# Altium schematic sheet CW308_TargetBoard.SchDoc: Target Connectors
size Letter; ApprovedBy: N; Organization: NewAE Technology Inc.; Address1: 1083 Queen St., Suite 196; Address2: Halifax; Address3: NS; Address4: Canada B3H 0B2; DocumentNumber: 5; SheetNumber: 5; SheetTotal: 5; SheetApproved: YES
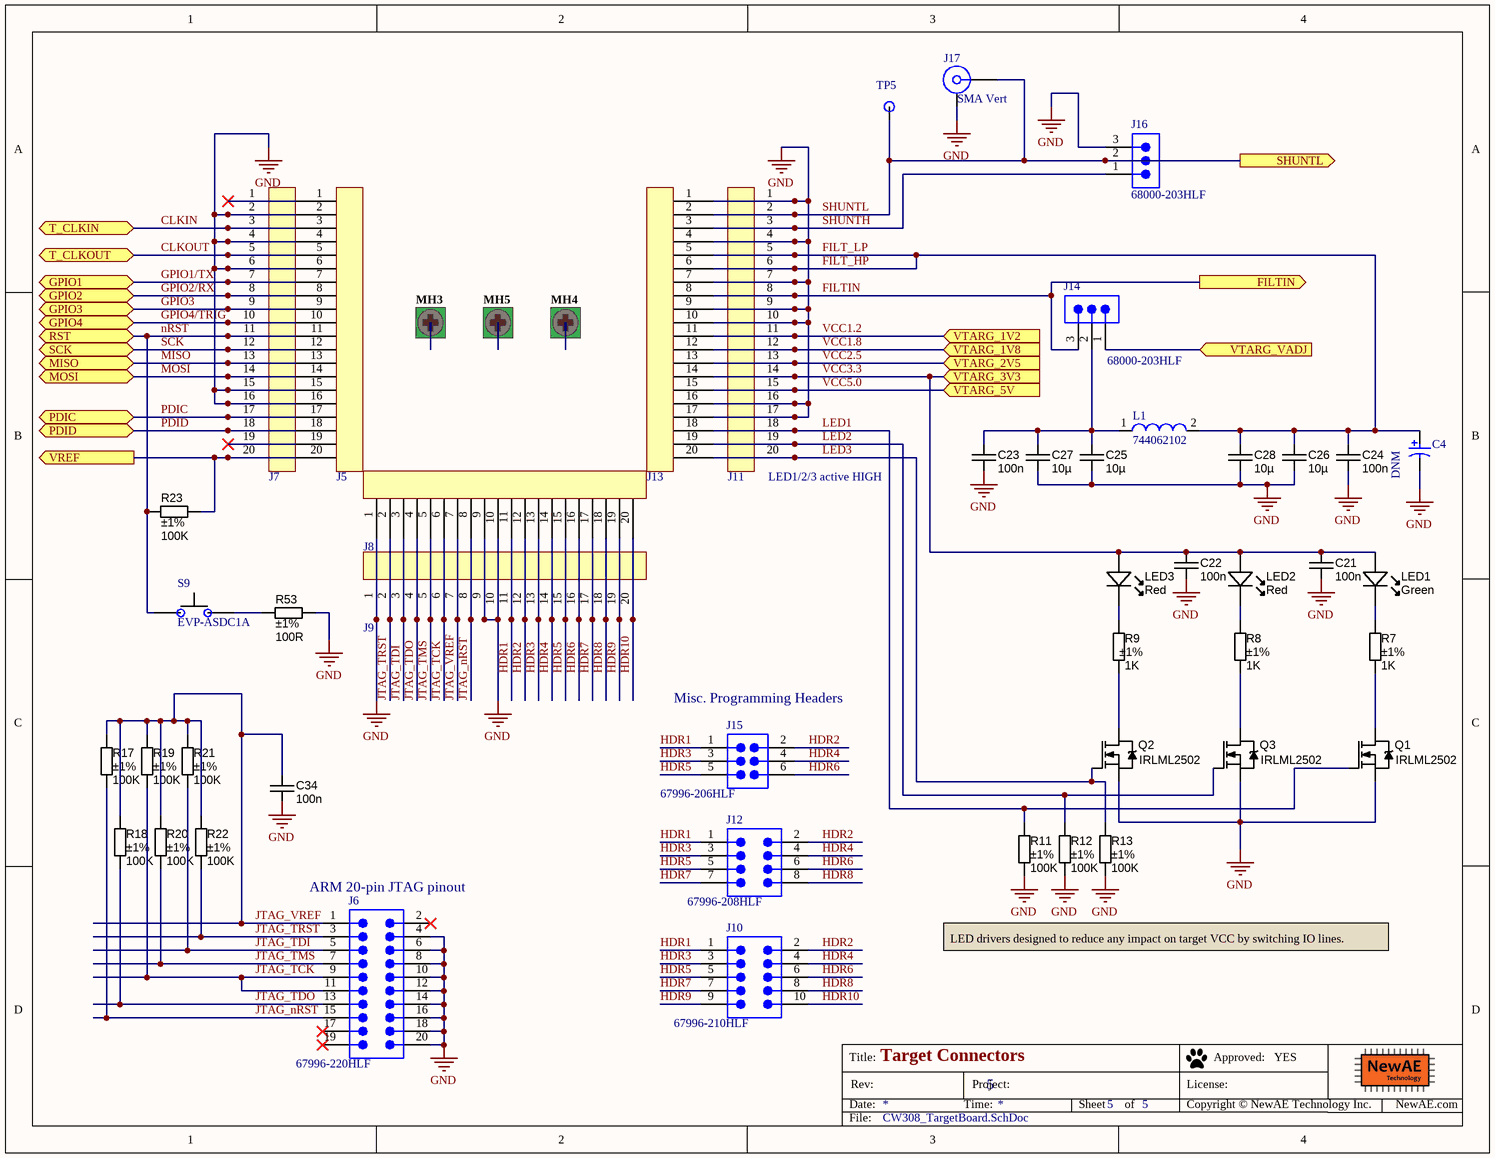
[diagram p0: CW308_TargetBoard.SchDoc]

## Parts
C4  DNM  [NIC-CAPA2-6.3X5.8_V]
C21  value 100n  [CAPC1608X90N]  (hidden comment: approved sub OK)
C22  value 100n  [CAPC1608X90N]  (hidden comment: approved sub OK)
C23  value 100n  [CAPC1608X90N]  (hidden comment: approved sub OK)
C24  value 100n  [CAPC1608X90N]  (hidden comment: approved sub OK)
C25  value 10µ  [CAPC2012X135N]  (hidden comment: approved sub OK)
C26  value 10µ  [CAPC2012X135N]  (hidden comment: approved sub OK)
C27  value 10µ  [CAPC2012X135N]  (hidden comment: approved sub OK)
C28  value 10µ  [CAPC2012X135N]  (hidden comment: approved sub OK)
C34  value 100n  [CAPC1608X90N]  (hidden comment: approved sub OK)
J5  20-Pin Header  [801-87-020-10-001101]  (value not drawn)
J6  67996-220HLF  [SMTC-MTSW-110-22-X-D-023]
J7  20-Pin Header  [801-87-020-10-001101]  (value not drawn)
J8  20-Pin Header  [801-87-020-10-001101]  (value not drawn)
J9  20-Pin Header  [801-87-020-10-001101]  (value not drawn)
J10  67996-210HLF  [SMTC-MTSW-105-07-X-D-230]
J11  20-Pin Header  [801-87-020-10-001101]  (value not drawn)
J12  67996-208HLF  [SMTC-MTSW-104-12-X-D-006]
J13  20-Pin Header  [801-87-020-10-001101]  (value not drawn)
J14  68000-203HLF  [SMTC-TSW-103-07-X-S]
J15  67996-206HLF  [SMTC-MTLW-103-06-X-D-180]
J16  68000-203HLF  [SMTC-TSW-103-07-X-S]
J17  SMA Vert  [SMA_VERT_1.65MMHOLE]
L1  744062102  [WE-TPC-6823-X]
LED1  Green  [LED-0603-GREEN]
LED2  Red  [LED-0603-RED]
LED3  Red  [LED-0603-RED]
MH3  Mounting-Hole-RND-Altium  [Mounting-Hole-RND-Altium]  (value not drawn)  (no BOM)
MH4  Mounting-Hole-RND-Altium  [Mounting-Hole-RND-Altium]  (value not drawn)  (no BOM)
MH5  Mounting-Hole-RND-Altium  [Mounting-Hole-RND-Altium]  (value not drawn)  (no BOM)
Q1  IRLML2502  [SOT23-3]
Q2  IRLML2502  [SOT23-3]
Q3  IRLML2502  [SOT23-3]
R7  value 1K  Tolerance: ±1%  [RESC1608X55N]  (hidden comment: Thick Film)
R8  value 1K  Tolerance: ±1%  [RESC1608X55N]  (hidden comment: Thick Film)
R9  value 1K  Tolerance: ±1%  [RESC1608X55N]  (hidden comment: Thick Film)
R11  value 100K  Tolerance: ±1%  [RESC1608X55N]  (hidden comment: Thick Film)
R12  value 100K  Tolerance: ±1%  [RESC1608X55N]  (hidden comment: Thick Film)
R13  value 100K  Tolerance: ±1%  [RESC1608X55N]  (hidden comment: Thick Film)
R17  value 100K  Tolerance: ±1%  [RESC1608X55N]  (hidden comment: Thick Film)
R18  value 100K  Tolerance: ±1%  [RESC1608X55N]  (hidden comment: Thick Film)
R19  value 100K  Tolerance: ±1%  [RESC1608X55N]  (hidden comment: Thick Film)
R20  value 100K  Tolerance: ±1%  [RESC1608X55N]  (hidden comment: Thick Film)
R21  value 100K  Tolerance: ±1%  [RESC1608X55N]  (hidden comment: Thick Film)
R22  value 100K  Tolerance: ±1%  [RESC1608X55N]  (hidden comment: Thick Film)
R23  value 100K  Tolerance: ±1%  [RESC1608X55N]  (hidden comment: Thick Film)
R53  value 100R  Tolerance: ±1%  [RESC1608X55N]  (hidden comment: Thick Film)
S9  EVP-ASDC1A  [EVPAS]
TP5  5008  [KEYSTONE5008]  (value not drawn)

## Ports
FILTIN (out), GPIO1 (bidir), GPIO2 (bidir), GPIO3 (bidir), GPIO4 (bidir), MISO (bidir), MOSI (bidir), PDIC (bidir), PDID (bidir), RST (bidir), SCK (bidir), SHUNTL (out), T_CLKIN (bidir), T_CLKOUT (bidir), VREF (out), VTARG_1V2 (in), VTARG_1V8 (in), VTARG_2V5 (in), VTARG_3V3 (in), VTARG_5V (in), VTARG_VADJ (in)

## Nets
GND: C4.2 C21.2 C22.2 C23.2 C24.2 C25.2 C26.2 C27.2 C28.2 C34.2 J5.2 J5.4 J5.6 J5.15 J5.16 J6.4 J6.6 J6.8 J6.10 J6.12 J6.14 J6.16 J6.18 J6.20 J7.2 J7.4 J7.6 J7.15 J7.16 J8.1 J8.9 J8.10 J9.1 J9.9 J9.10 J11.1 J11.4 J11.7 J11.9 J11.10 J11.16 J11.17 J13.1 J13.4 J13.7 J13.9 J13.10 J13.16 J13.17 J16.3 J17.MH Q1.2(S) Q2.2(S) Q3.2(S) R11.2 R12.2 R13.2 R53.2
CLKIN: J5.3 J7.3 ; port T_CLKIN
CLKOUT: J5.5 J7.5 ; port T_CLKOUT
FILT_HP: C4.1 C24.1 C26.1 C28.1 J11.5 J11.6 J13.5 J13.6 L1.2  [also labelled FILT_LP]
FILTIN: J11.8 J13.8 J14.3 ; port FILTIN
GPIO1/TX: J5.7 J7.7 ; port GPIO1
GPIO2/RX: J5.8 J7.8 ; port GPIO2
GPIO3: J5.9 J7.9 ; port GPIO3
GPIO4/TRIG: J5.10 J7.10 ; port GPIO4
HDR1: J8.11 J9.11 J10.1 J12.1 J15.1
HDR2: J8.12 J9.12 J10.2 J12.2 J15.2
HDR3: J8.13 J9.13 J10.3 J12.3 J15.3
HDR4: J8.14 J9.14 J10.4 J12.4 J15.4
HDR5: J8.15 J9.15 J10.5 J12.5 J15.5
HDR6: J8.16 J9.16 J10.6 J12.6 J15.6
HDR7: J8.17 J9.17 J10.7 J12.7
HDR8: J8.18 J9.18 J10.8 J12.8
HDR9: J8.19 J9.19 J10.9
HDR10: J8.20 J9.20 J10.10
JTAG_nRST: J6.15 J8.8 J9.8 R17.2
JTAG_TCK: J6.9 J6.11 J8.6 J9.6 R19.2
JTAG_TDI: J6.5 J8.3 J9.3 R21.2
JTAG_TDO: J6.13 J8.4 J9.4 R18.2
JTAG_TMS: J6.7 J8.5 J9.5 R20.2
JTAG_TRST: J6.3 J8.2 J9.2 R22.2
JTAG_VREF: C34.1 J6.1 J8.7 J9.7 R17.1 R18.1 R19.1 R20.1 R21.1 R22.1
LED1: J11.18 J13.18 Q1.1(G) R11.1
LED2: J11.19 J13.19 Q3.1(G) R12.1
LED3: J11.20 J13.20 Q2.1(G) R13.1
MISO: J5.13 J7.13 ; port MISO
MOSI: J5.14 J7.14 ; port MOSI
nRST: J5.11 J7.11 R23.1 S9.1(IN) ; port RST
PDIC: J5.17 J7.17 ; port PDIC
PDID: J5.18 J7.18 ; port PDID
SCK: J5.12 J7.12 ; port SCK
SHUNTH: J11.3 J13.3 J16.1
SHUNTL: J11.2 J13.2 J16.2 J17.1 TP5.1 ; port SHUNTL
VCC1.2: J11.11 J13.11 ; port VTARG_1V2
VCC1.8: J11.12 J13.12 ; port VTARG_1V8
VCC2.5: J11.13 J13.13 ; port VTARG_2V5
VCC3.3: C21.1 C22.1 J11.14 J13.14 LED1.A LED2.A LED3.A ; port VTARG_3V3
VCC5.0: J11.15 J13.15 ; port VTARG_5V
VREF: J5.20 J7.20 R23.2 ; port VREF
VTARG_VADJ: J14.1 ; port VTARG_VADJ
NetC23_1: C23.1 C25.1 C27.1 J14.2 L1.1
NetJ5_1: J5.1 J7.1
NetJ5_19: J5.19 J7.19
NetLED1_K: LED1.K R7.1
NetLED2_K: LED2.K R8.1
NetLED3_K: LED3.K R9.1
NetQ1_3: Q1.3(D) R7.2
NetQ2_3: Q2.3(D) R9.2
NetQ3_3: Q3.3(D) R8.2
NetR53_1: R53.1 S9.2(IN)

Not connected (* = marked no-connect by the designer): J6 2* 17* 19*; MH3 1; MH4 1; MH5 1

## Notes on the sheet
- (near J11) LED1/2/3 active HIGH
- (near J15) Misc. Programming Headers
- (near J6) ARM 20-pin JTAG pinout
- LED drivers designed to reduce any impact on target VCC by switching IO lines.
- Title:
- Date:
- Rev:
- Time:
- Project:
- Sheet
- of
- License:
- Copyright © NewAE Technology Inc.
- Approved:
- NewAE.com
- File:

## Library data of the parts
C4 = CMP-0687-00052-1: Aluminum Electrolytic Capacitor, UD Series, Low Impedance, 150 uF, 10 V, + / - 20%, -55 to 105 degC, Chip Type, 6.3 x 5.8 mm D x L, Pb-Free, Reel; Manufacturer: Nichicon; PartNumber: UUD1A151MCL1GS; Tolerance Rated Capacitance: -20 to 20%; Endurance Time: 2000 h; Rated Voltage: 10 V; Impedance: 0.44 Ohm; Rated Capacitance: 150 uF; Rated Ripple Current (at 100kHz): 230 mA; Packing: Dia382mm Reel; RoHS: TRUE; ComponentLink1URL: http://www.nichicon.co.jp/; Mounting Technology: Surface Mount; Length: 5.8 mm; ComponentLink3URL: http://products.nichicon.co.jp/en/pdf/XJA043/e-ud.pdf; ComponentLink1Description: Manufacturer URL; ComponentLink2URL: http://products.nichicon.co.jp/en/pdf/XJA043/e-ud.pdf; DatasheetVersion: 08/2012; ComponentLink3Description: Package Specification; ComponentLink2Description: Datasheet; Diameter: 6.3 mm; PackageDescription: 2-Pin Surface Mount Device, Diameter 6.3 mm, Height 5.8 mm, Pitch 5.4 mm; PackageReference: CAPAE-D6.3H5.8; Supplier 1: Digi-Key; Supplier Part Number 1: 493-2249-1-ND
C21-C24 C34 = CAPC_100n_0603_X7R_50V_10%: Capacitor SMD Cer 100nF 10% 50V X7R 0603; Manufacturer 1: AVX Corporation; Manufacturer Part Number 1: 06035C104KAT2A; Ratings: 50V; X7R; Material: ceramic; SCDType: spec; Manufacturer 2: TDK Corporation; Manufacturer Part Number 2: C1608X7R1H104K; Package / Case: 0603 (1608 Metric); Tolerance: ±10%; Supplier 1: Digi-Key; Supplier Part Number 1: 478-5052-1-ND; ComponentLink1URL: http://www.avx.com/docs/Catalogs/cx7r.pdf; ComponentLink1Description: http://www.avx.com/docs/Catalogs/cx7r.pdf; Supplier 2: Digi-Key; Supplier Part Number 2: 445-1314-1-ND; ComponentLink2URL: http://product.tdk.com/capacitor/mlcc/en/documents/mlcc_commercial_general_en.pdf; ComponentLink2Description: http://product.tdk.com/capacitor/mlcc/en/documents/mlcc_commercial_general_en.pdf
C25-C28 = CAPC_10u_0805_10V: Capacitor SMD Cer 10uF 10% 10V X5R 0805; Manufacturer 1: AVX Corporation; Manufacturer Part Number 1: 0805ZD106KAT2A; Ratings: 10V; X5R; Material: ceramic; SCDType: spec; Package / Case: 0805 (2012 metric); Tolerance: ±10%; Manufacturer 2: Kemet; Manufacturer Part Number 2: C0805C106K8PACTU; Supplier 1: Digi-Key; Supplier Part Number 1: 478-5167-1-ND; ComponentLink1URL: http://www.avx.com/docs/Catalogs/cx5r.pdf; ComponentLink1Description: http://www.avx.com/docs/Catalogs/cx5r.pdf; ComponentLink2URL: http://www.kemet.com/datasheets&C0805C106K8PACTU; ComponentLink2Description: http://www.kemet.com/datasheets&C0805C106K8PACTU; Supplier 2: Digi-Key; Supplier Part Number 2: 399-4925-1-ND
J5 J8 J13 = 801-87-020-10-001101: 1x20 Header, Male; Manufacture Part Number 1: 68000-220HLF; Manufacture 1: Amphenol FCI; Supplier 1: Digi-Key; Supplier Part Number 1: 609-5100-ND
J6 = CMP-1024-00146-1: Manufacturer: Amphenol FCI; Pitch: 2.54 mm; Mounting Technology: Through-hole; PartNumber: 67996-220HLF; RoHS: True; Orientation: Vertical; Temperature Range: -55 to 105 degC; Supplier 1: Digi-Key; Supplier Part Number 1: 609-3214-ND
J7 J9 J11 = 801-87-020-10-001101: 1x20 Header, Machined; Manufacture 1: Preci-Dip SA; Manufacture Part Number 1: 801-87-020-10-001101; Supplier 1: Digi-Key; Supplier Part Number 1: 1212-1207-ND
J10 = CMP-1024-00112-1: Manufacturer: Amphenol FCI; Pitch: 2.54 mm; Orientation: Vertical; Mounting Technology: Through-hole; PartNumber: 67996-210HLF; RoHS: True; Temperature Range: -55 to 125 degC; Supplier 1: Digi-Key; Supplier Part Number 1: 609-3212-ND
J12 = CMP-1024-00110-1: Manufacturer: Amphenol FCI; Pitch: 2.54 mm; Temperature Range: -55 to 105 degC; Orientation: Vertical; PartNumber: 67996-208HLF; Mounting Technology: Through-hole; RoHS: True; Supplier 1: Digi-Key; Supplier Part Number 1: 609-3211-ND
J14 J16 = CMP-1024-00333-1: Pitch: 2.54 mm; Temperature Range: -55 to 125 degC; RoHS: True; Orientation: Vertical; PackageDescription: .025[0.64] SQ. Post Terminal Strip Assembly; Mounting Technology: Through-hole; PartNumber: 68000-203HLF; Supplier 1: Digi-Key; Supplier Part Number 1: 609-3464-ND
J15 = CMP-1024-00068-1: Manufacturer: Amphenol FCI; Pitch: 2.54 mm; PartNumber: 67996-206HLF; Orientation: Vertical; PackageDescription: Low Profile Terminal Assembly; Temperature Range: -55 to 125 degC; RoHS: True; Mounting Technology: Through-hole; Supplier 1: Digi-Key; Supplier Part Number 1: 609-3210-ND
J17 = 5-1814832-1: SMA, Vert; Manufacture: TE Connectivity; Supplier 1: Digi-Key; Supplier Part Number 1: A97594-ND; PartNumber: 5-1814832-1
L1 = CMP-0227-00387-1: SMD Shielded Tiny Power Inductor WE-TPC, L = 1000 µH; Inductance: 1000 ÂµH; DatasheetVersion: ver 4, Apr-2008; ComponentLink1Description: Manufacturer Link; ComponentLink2Description: Datasheet; PackageReference: WE-TPC-6823-X; PackageDescription: SMD Inductor, 2-Leads, Body 6.8 x 6.8 mm; ComponentLink1URL: http://www.we-online.com; ComponentLink2URL: http://www.we-online.de/katalog/media/pdf/744062102.pdf; PackageVersion: 2009; Supplier 1: Digi-Key; Supplier Part Number 1: 732-3676-1-ND
LED1 = LED_SMD_Green_0603_570nm: LED 0603 SMD Green 570nm 50mcd 20mA; Manufacturer 1: Kingbright Company LLC; Manufacturer Part Number 1: APT1608CGCK; Material: AlGaInP; Ratings: 20mcd min; 50 mcd typ; 570 nm; Voltage - Forward (Vf) Typ: 2.1V; Viewing Angle: 120°; Lens Style/Size: Rectangle with Flat Top, 1.1mm x 0.8mm; Voltage - Forward (Vf) @ 10mA: 2.0V; SCDType: source; Wavelength - Peak: 574nm; Lens Type: Clear; Package / Case: 0603 (1608 metric); Color: Green; Current - Test: 20mA; Supplier 1: Digi-Key; Supplier Part Number 1: 754-1116-1-ND; RoHS 1: RoHS Compliant; Wavelength - Dominant: 570nm; ComponentLink1URL: http://www.us.kingbright.com/images/catalog/SPEC/APT1608CGCK.pdf; ComponentLink1Description: http://www.us.kingbright.com/images/catalog/SPEC/APT1608CGCK.pdf
LED2 LED3 = LED_SMD_Red_0603_220mcd: LED 0603 SMD Hyper Red 630nm 220mcd 20mA; Manufacturer 1: Kingbright Company LLC; Manufacturer Part Number 1: APT1608SURCK; Material: AlGaInP on GaAs; Ratings: 220 mcd; 630 nm; Voltage - Forward (Vf) Typ: 1.95V; Voltage - Forward (Vf) @ 10mA: 1.9V; SCDType: source; Package / Case: 0603 (1608 metric); Supplier 1: Digi-Key; Supplier Part Number 1: 754-1123-1-ND; ComponentLink1URL: http://www.us.kingbright.com/images/catalog/SPEC/APT1608SURCK.pdf; ComponentLink1Description: http://www.us.kingbright.com/images/catalog/SPEC/APT1608SURCK.pdf
MH3-MH5 = CMP-0001-00029-1: Mounting Hole, Altium, 4.4mm pad, 3.4mm plated hole; Publisher: Altium; ClassName: Mounting Hole
Q1-Q3 = MOSFET_IRLML2502: MOSFET SMD N-CH 20V 4.2A SOT23-3; Manufacturer 1: Diodes Inc; Manufacturer Part Number 1: IRLML2502TRPBF; Ratings: 20V; 4.2A; Material: Metal Oxide; SCDType: source; Package / Case: SOT23-3; Supplier 1: Digi-Key; Supplier Part Number 1: IRLML2502PBFCT-ND
R7-R9 = RES_1K_0603_1%: Resistor SMD chip 1k Ohm 0.1W 1% 0603; Manufacturer 1: Yageo; Manufacturer Part Number 1: RC0603FR-071KL; Ratings: 1/10W; SCDType: spec; Package / Case: 0603 (1608 Metric); Supplier 1: Digi-Key; Supplier Part Number 1: 311-1.00KHRCT-ND
R11-R13 R17-R23 = RES_100K_0603_1%: Resistor SMD chip 100k Ohm 0.1W 1% 0603; Manufacturer 1: Vishay/Dale; Manufacturer Part Number 1: CRCW0603100KFKEA; Ratings: 1/10W; SCDType: spec; Package / Case: 0603 (2012 metric); Supplier 1: Digi-Key; Supplier Part Number 1: 541-100KHCT-ND
R53 = RES_100R_0603_1%: Resistor SMD chip 100 Ohm 0.1W 1% 0603; Manufacturer 1: Yageo; Manufacturer Part Number 1: RC0603FR-07100RL; Ratings: 1/10 W; SCDType: spec; Package / Case: 0603 (1608 Metric); Material: Thick Film; Supplier 1: Digi-Key; Supplier Part Number 1: 311-100HRCT-ND; Supplier 2: Digi-Key; Supplier Part Number 2: P100HTR-ND; Manufacturer 2: Panasonic - ECG; Manufacturer Part Number 2: ERJ-3EKF1000V; ComponentLink1URL: http://industrial.panasonic.com/www-cgi/jvcr13pz.cgi?E+PZ+3+AOA0002+ERJ3EKF1000V+7+WW; ComponentLink1Description: http://industrial.panasonic.com/www-cgi/jvcr13pz.cgi?E+PZ+3+AOA0002+ERJ3EKF1000V+7+WW
S9 = EVP-ASDC1A: Pushbutton, SMD, 2.5NM force, NO; Manufacture 1: Panasonic; Component Group: Switch; Rated Power: 0.1W; Rated Voltage: 75VDC; Part Number: EVP-ASDC1A; Manufacture Part Number 1: EVP-ASDC1A; Pin Count: 2; Supplier 1: Digi-Key; Supplier Part Number 1: P16856CT-ND; Mounting Technology: SMT; Component Kind: Standard; Component Type: Standard
TP5 = KEYSTONE_5008: TEST POINT PC COMPACT .063"D ORG; Supplier 1: Digi-Key; Supplier Part Number 1: 36-5008-ND